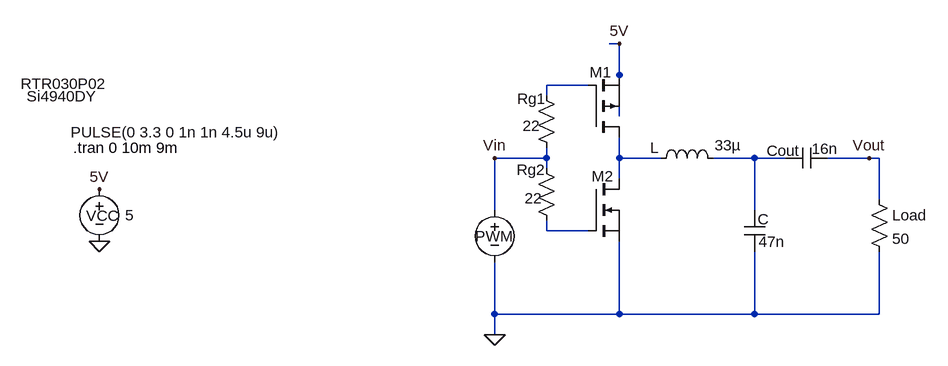
[diagram p0: schematic CLASS D Amplifier.asc]
CLASS D Amplifier.asc, the LTspice schematic file:
Version 4
SHEET 1 880 680
WIRE 176 -112 160 -112
WIRE 176 -64 176 -112
WIRE 128 -48 64 -48
WIRE 64 -32 64 -48
WIRE 176 0 176 -64
WIRE 64 64 64 48
WIRE 64 64 -16 64
WIRE 176 64 176 32
WIRE 240 64 176 64
WIRE 384 64 320 64
WIRE 432 64 384 64
WIRE 560 64 496 64
WIRE 576 64 560 64
WIRE 64 80 64 64
WIRE 176 96 176 64
WIRE 576 128 576 64
WIRE -16 144 -16 64
WIRE 384 144 384 64
WIRE 64 176 64 160
WIRE 128 176 64 176
WIRE -16 304 -16 224
WIRE 176 304 176 192
WIRE 176 304 -16 304
WIRE 384 304 384 208
WIRE 384 304 176 304
WIRE 576 304 576 208
WIRE 576 304 384 304
WIRE -16 336 -16 304
FLAG 176 -112 5V
FLAG 560 64 Vout
FLAG -624 112 5V
FLAG -624 192 0
FLAG -16 64 Vin
FLAG -16 336 0
SYMBOL voltage -16 128 R0
WINDOW 123 0 0 Left 0
WINDOW 39 0 0 Left 0
WINDOW 0 -30 56 Left 2
WINDOW 3 -652 -104 Left 2
SYMATTR InstName PWM
SYMATTR Value PULSE(0 3.3 0 1n 1n 4.5u 9u)
SYMBOL voltage -624 96 R0
WINDOW 0 -20 57 Left 2
WINDOW 3 40 56 Left 2
WINDOW 123 0 0 Left 0
WINDOW 39 0 0 Left 0
SYMATTR InstName VCC
SYMATTR Value 5
SYMBOL nmos 128 96 R0
WINDOW 3 -864 -127 Left 2
WINDOW 0 2 -164 Left 2
SYMATTR Value Si4940DY
SYMATTR InstName M1
SYMBOL pmos 128 32 M180
WINDOW 3 -873 82 Left 2
WINDOW 0 5 -60 Left 2
SYMATTR Value RTR030P02
SYMATTR InstName M2
SYMBOL ind 224 80 R270
WINDOW 0 16 6 VTop 2
WINDOW 3 51 119 VBottom 2
SYMATTR InstName L
SYMATTR Value 33µ
SYMATTR SpiceLine Ipk=20 Rser=0
SYMBOL cap 368 144 R0
WINDOW 0 21 14 Left 2
WINDOW 3 22 49 Left 2
SYMATTR InstName C
SYMATTR Value 47n
SYMBOL cap 496 48 R90
WINDOW 0 20 68 VBottom 2
WINDOW 3 -14 4 VTop 2
SYMATTR InstName Cout
SYMATTR Value 16n
SYMATTR SpiceLine Rpar=0
SYMBOL res 560 112 R0
SYMATTR Value 50
SYMATTR InstName Load
SYMBOL res 48 -48 R0
WINDOW 3 -21 62 Left 2
WINDOW 0 -29 21 Left 2
SYMATTR Value 22
SYMATTR InstName Rg1
SYMBOL res 48 64 R0
WINDOW 3 -18 62 Left 2
WINDOW 0 -30 18 Left 2
SYMATTR Value 22
SYMATTR InstName Rg2
TEXT -664 48 Left 2 !.tran 0 10m 9m

The netlist it stands for:
* CLASS D Amplifier.asc
V§PWM Vin 0 PULSE(0 3.3 0 1n 1n 4.5u 9u)
VCC 5V 0 5
M1 N002 N004 0 0 Si4940DY
M2 N002 N001 5V 5V RTR030P02
L N002 N003 33µ Ipk=20 Rser=0
C N003 0 47n
Cout Vout N003 16n Rpar=0
R§Load Vout 0 50
Rg1 N001 Vin 22
Rg2 Vin N004 22
.model NMOS NMOS
.model PMOS PMOS
.lib standard.mos
.tran 0 10m 9m
.backanno
.end